# EAGLE design kicker board (EAGLE 4.16)
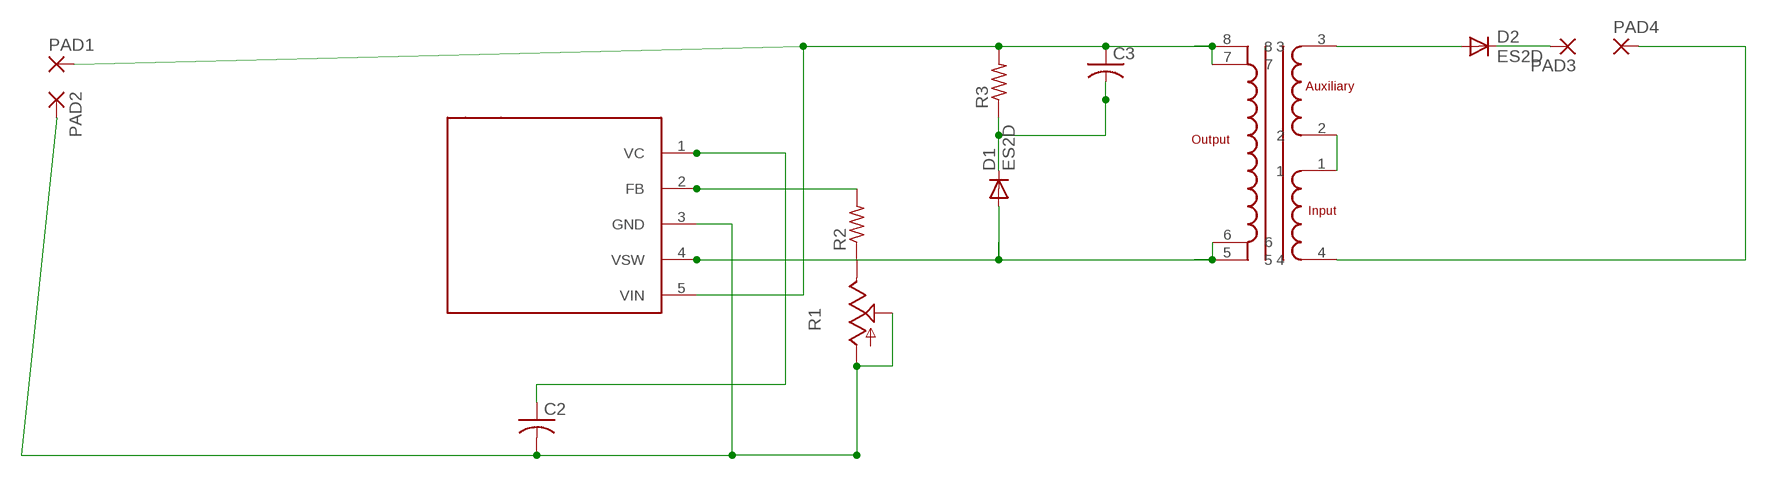
[diagram p0: schematic, sheet 1]

## Parts
C2  C-USC0805  [C0805]
C3  C-USC0805  [C0805]
D1  ES2D  [SMB]
D2  ES2D  [SMB]
PAD1  2,54/0,9  [2,54/0,9]
PAD2  2,54/0,9  [2,54/0,9]
PAD3  2,54/0,9  [2,54/0,9]
PAD4  2,54/0,9  [2,54/0,9]
R1  TRIM_US-B25P  [B25P]
R2  R-US_M0805  [M0805]
R3  R-US_R0805  [R0805]
U$1  LT1070  [TO220-5]
U$2  A0009-AL  [SM]

## Nets
N$1: C3.1 PAD1.1(P) R3.2 U$1.5(VIN) U$2.7 U$2.8
N$2: D2.A U$2.3
N$3: D1.A U$1.4(VSW) U$2.5 U$2.6
N$4: R1.E R2.1
N$5: C3.2 D1.C R3.1
N$6: D2.C PAD3.1(P)
N$7: C2.1 U$1.1(VC)
N$8: R2.2 U$1.2(FB)
N$10: C2.2 PAD2.1(P) R1.A R1.S U$1.3(GND)
N$12: U$2.1 U$2.2
N$13: PAD4.1(P) U$2.4

## Library data of the parts
C2 C3 = rcl:C-US: CAPACITOR, American symbol
D1 D2 = diode:ES2D: DIODE super fast rectifier, 2 A
PAD1-PAD4 = wirepad:2,54/0,9: THROUGH-HOLE PAD
R1 = pot:TRIM_US-: POTENTIOMETER
R2 R3 = rcl:R-US_: RESISTOR, American symbol
U$1 = linear-technology:LT1070
U$2 = Kicker2:A0009-AL

## Board
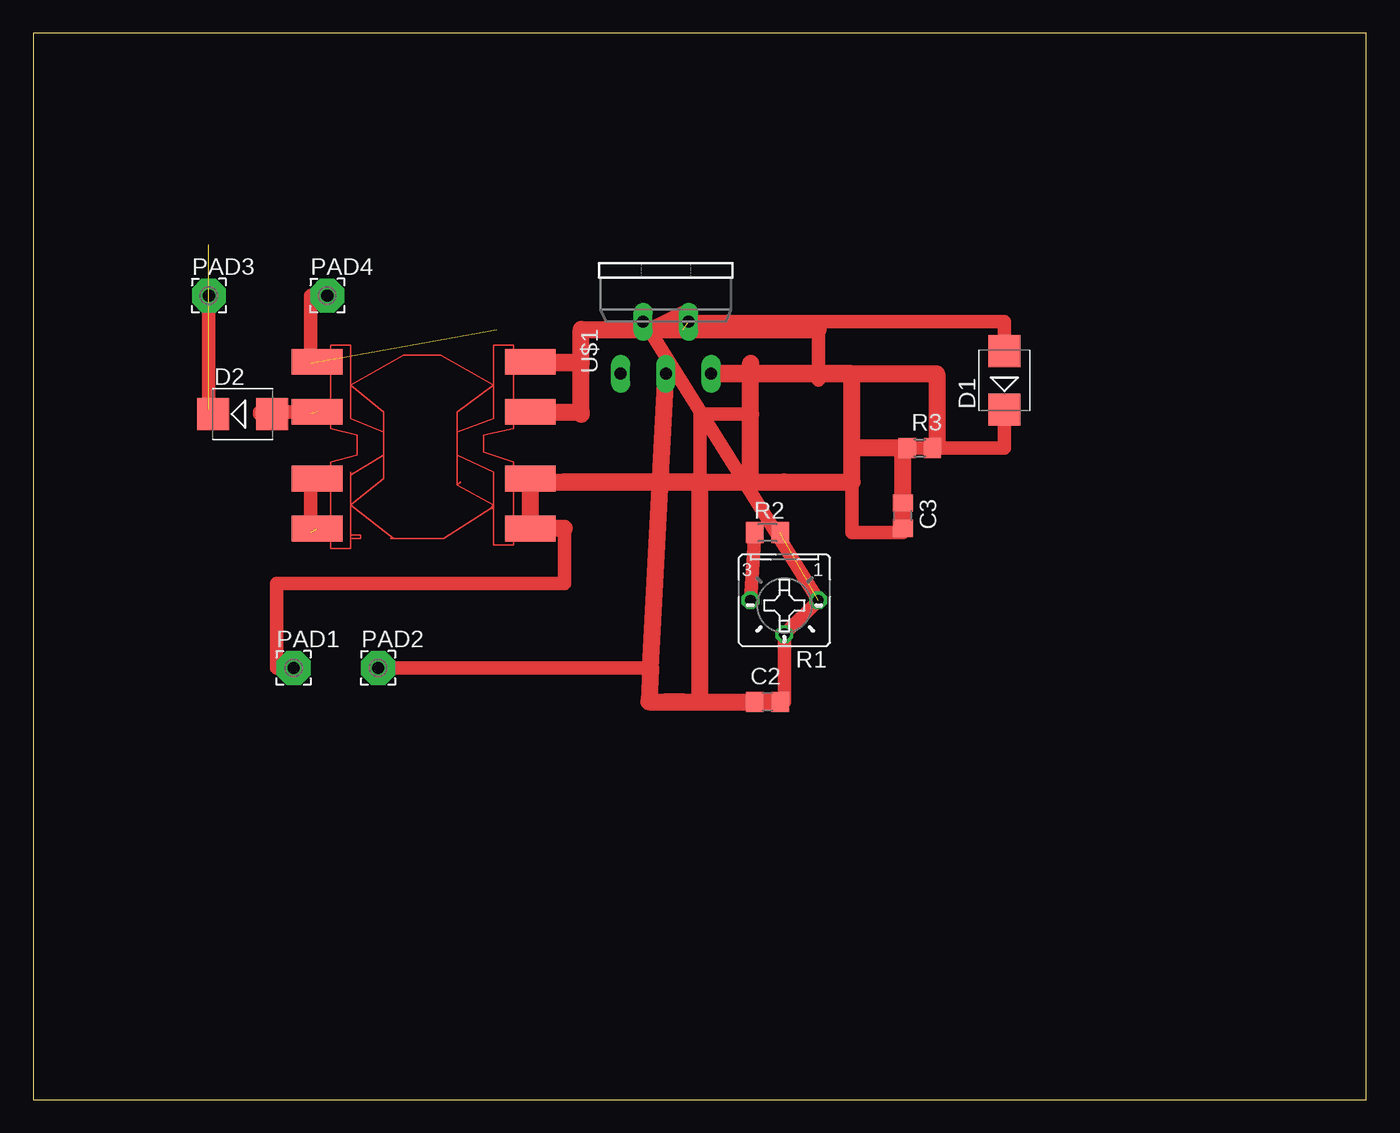
[diagram p1: board, top side]
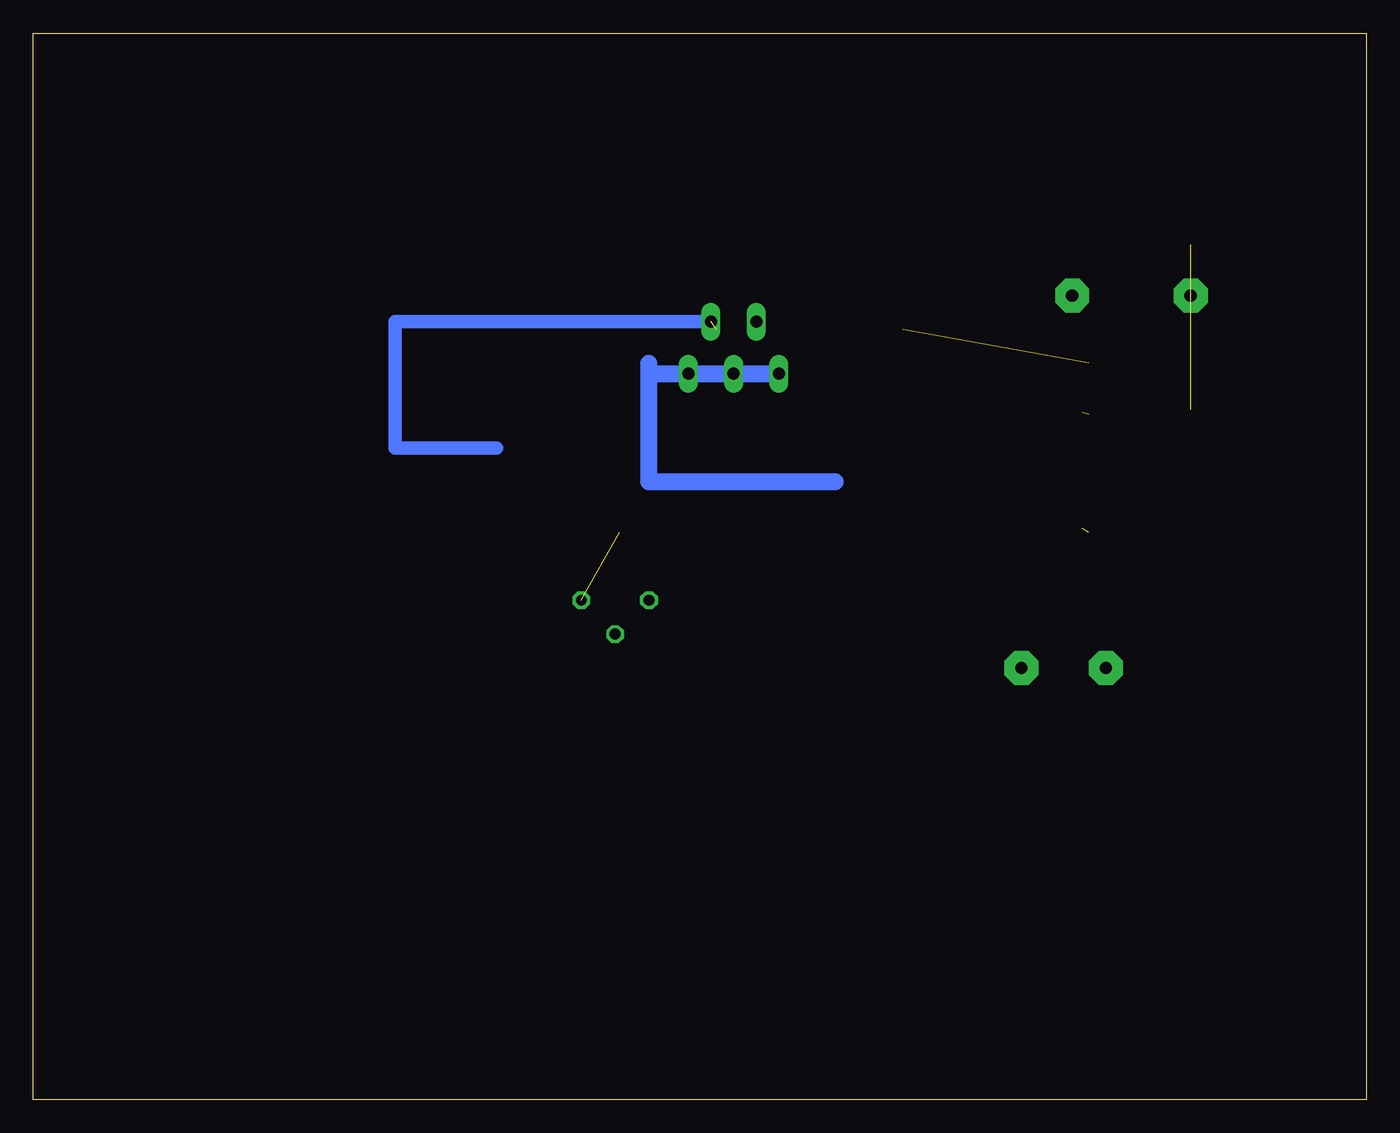
[diagram p2: board, bottom side, seen from below]

Size 100 x 80 mm. Coordinates in mm from the lower left corner, seen from the top.
Outline: 0,0 100,0 100,80 0,80 0,0
Copper layers (1*16): Top 0.035mm / dielectric 1.5mm / Bottom 0.035mm
Design rules "default": minimum track width 10mil, minimum drill 24mil, track to track 8mil, track to pad 8mil, pad to pad 8mil, via to via 8mil, smd to smd 8mil, copper to edge 40mil, drill to drill 8mil, minimum pad ring 10mil, minimum via ring 8mil, stop-mask expansion 4mil, vias tented up to drill 0mil, thermal gap 10mil

### Footprints (pad centres in the part's own frame; a part is rotated, then mirrored left to right if it is on the bottom)
C0805 = smd 1.3 x 1.5: 1 -0.95,0; 2 0.95,0
SMB = smd 2.4 x 2.4: A 2.2,0; C -2.2,0
2,54/0,9 = drill 0.914 pad 2.54 octagon: 1 0,0
B25P = drill 0.813 octagon: A -2.54,0; E 2.54,0; S 0,2.54
M0805 = smd 1.3 x 1.6: 1 -0.95,0; 2 0.95,0
R0805 = smd 1.3 x 1.5: 1 -0.95,0; 2 0.95,0
TO220-5 = drill 0.9 long: 1 -3.4,-8.4; 2 -1.7,-4.5; 3 0,-8.4; 4 1.7,-4.5; 5 3.4,-8.4
SM = smd 3.81 x 1.93: 1 0.5,-3.5; 2 0.5,0.25; 3 0.5,5.25; 4 0.5,9; 5 16.5,9; 6 16.5,5.25; 7 16.5,0.25; 8 16.5,-3.5

### Placement (x,y rotation side)
C2  55.08,29.84 0 top
C3  65.24,43.81 270 top
D1  72.86,53.97 90 top
D2  15.71,51.43 0 top
PAD1  19.52,32.38 0 top
PAD2  25.87,32.38 0 top
PAD3  13.17,60.32 0 top
PAD4  22.06,60.32 0 top
R1  56.35,37.46 180 top
R2  55.08,42.54 0 top
R3  66.51,48.89 0 top
U$1  47.46,62.86 0 top
U$2  20.79,46.35 0 top

### Tracks (layer width: path | path; a pad name or v marks a point on that pad's centre or on a via)
N$1
  Top 1.016: 39.84,42.85 39.84,38.73 18.25,38.73 18.25,32.38 PAD1.1 | 61.43,46.35 61.43,42.54 65.24,42.54 C3.1 65.24,45.08
  Top 1.27: R3.2 67.78,48.89 67.78,54.46 U$1.5 61.43,54.46 61.43,46.35 37.3,46.35 U$2.7 | U$2.8 37.3,42.54 | U$2.8 39.84,42.85 | U$2.7 | U$2.8 U$2.7
N$2  (1 unrouted)
  Top 1.016: 22.06,51.43 20.79,51.43 | D2.A 16.98,51.43 16.98,51.6 U$2.3
N$3  (1 unrouted)
  Top 1.016: U$1.4 72.86,58.36 D1.A | 58.89,57.78 58.89,53.97 | 48.73,57.78 48.73,59.05 46.19,57.78
  Top 1.27: U$2.6 41.11,51.6 | 41.11,51.6 41.11,51.43 | 41.11,51.6 41.11,55.24 37.3,55.24 U$2.5 41.11,55.35 41.11,57.78 46.19,57.78 48.73,57.78 58.89,57.78
  Bottom 1.016: U$1.4 72.86,58.36 72.86,48.89 65.24,48.89
N$4
  Top 1.016: R2.1 R1.E
N$5
  Top 1.016: R3.1 72.86,48.89 D1.C
  Top 1.27: C3.2 65.24,48.89 R3.1 61.43,48.89 61.43,53.97
N$6  (1 unrouted)
  Top 1.016: 13.17,51.77 arc90 D2.C 13.17,51.43 PAD3.1
N$7
  Top 1.016: 50,46.35 50,51.43 53.81,51.43
  Top 1.27: C2.1 50,29.84 50,46.35 | 53.81,46.35 53.81,51.43 53.81,55.24 | 50,46.35 53.81,46.35 | 53.81,46.35 56.35,46.35 | 50,46.35 39.84,46.35
  Bottom 1.27: U$1.1 53.81,54.46 53.81,46.35 | 39.84,46.35 53.81,46.35 | 53.81,46.35 53.81,55.24
N$8  (2 unrouted)
  Top 1.016: 46.19,57.78 44.92,57.78 | 46.19,57.78 U$1.2 | 46.19,57.78 50,57.78 | 58.89,37.46 46.19,57.78
N$10
  Top 1.016: 46.19,29.84 47.46,29.84 | C2.2 56.35,29.84 R1.S R1.A | 46.32,32.37 46.32,32.38 PAD2.1
  Top 1.27: 48.73,29.84 53.81,29.84 | 48.73,29.84 47.46,29.84 | 48.73,29.84 C2.2 | 48.73,29.84 46.19,29.84 46.32,32.37 U$1.3
N$12  (1 unrouted)
  Top 1.016: U$2.2 20.79,46.6 20.79,46.35 20.79,42.54
N$13  (1 unrouted)
  Top 1.016: U$2.4 20.79,55.35 20.79,57.78 | 20.79,57.78 20.79,60.32 PAD4.1 | 20.79,57.78 20.79,55.24